# Altium project pollution_analyser.PrjPCB
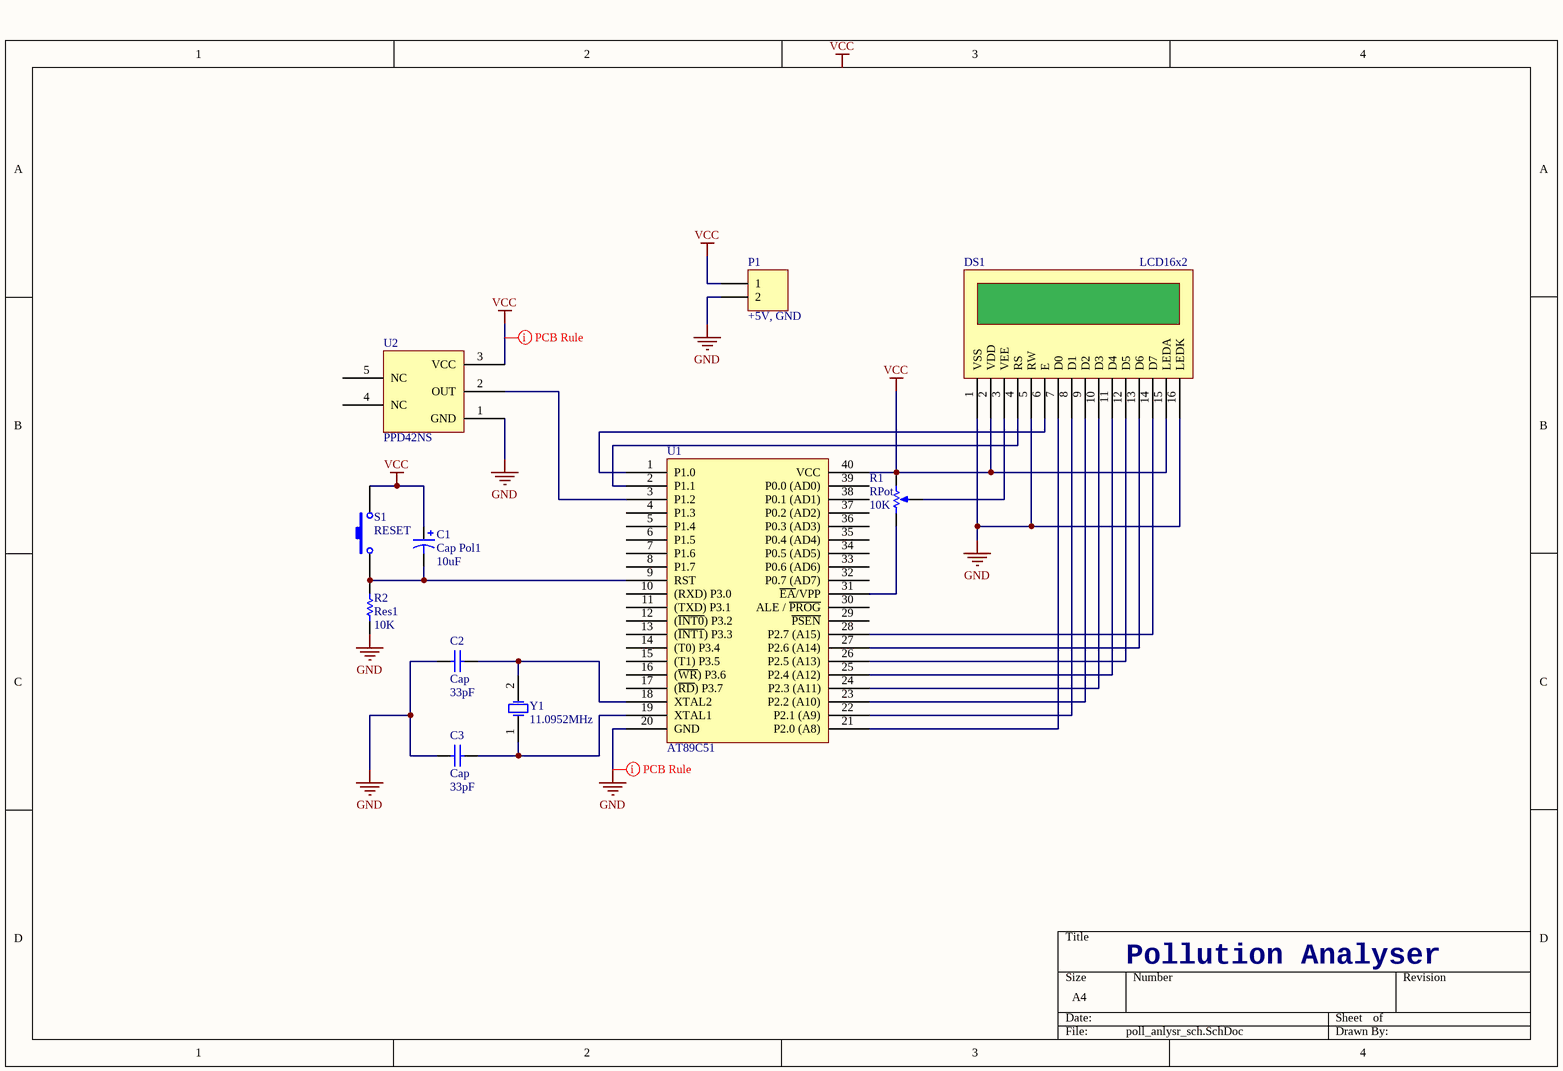
[diagram p0: poll_anlysr_sch.SchDoc]
1 sheet, 11 parts. Net scope: global (net labels, ports and power ports of the same name join across sheets).
Board file: poll_anlysr_pcb.PcbDoc

## Sheet poll_anlysr_sch.SchDoc
size A4

### Parts
C1  Cap Pol1  value 10uF  [CAPR5-4X5]
C2  Cap  value 33pF  [CAPR5-4X5]
C3  Cap  value 33pF  [CAPR5-4X5]
DS1  LCD16x2  [LCD_16x2]
P1  +5V, GND  [HDR1X2]
R1  RPot  value 10K  [Rpot]
R2  Res1  value 10K  [AXIAL-0.3]
S1  RESET  [SWpush]
U1  AT89C51  [AT89C51]
U2  PPD42NS  [PPD42NS]
Y1  11.0952MHz  [HC-49U]

### Nets
GND: C2.1 C3.1 DS1.1(VSS) DS1.5(RW) DS1.16(LEDK) P1.2 R2.2 U1.20(GND) U2.1(GND)
VCC: C1.1 DS1.2(VDD) DS1.15(LEDA) P1.1 R1.2(BOT) S1.2 U1.40(VCC) U2.3(VCC)
NetC1_2: C1.2 R2.1 S1.1 U1.9(RST)
NetC2_2: C2.2 U1.18(XTAL2) Y1.2(OSC2)
NetC3_2: C3.2 U1.19(XTAL1) Y1.1(OSC1)
NetDS1_3: DS1.3(VEE) R1.3(TAP)
NetDS1_4: DS1.4(RS) U1.2(P1.1)
NetDS1_6: DS1.6(E) U1.1(P1.0)
NetDS1_7: DS1.7(D0) U1.21(P2.0_(A8))
NetDS1_8: DS1.8(D1) U1.22(P2.1_(A9))
NetDS1_9: DS1.9(D2) U1.23(P2.2_(A10))
NetDS1_10: DS1.10(D3) U1.24(P2.3_(A11))
NetDS1_11: DS1.11(D4) U1.25(P2.4_(A12))
NetDS1_12: DS1.12(D5) U1.26(P2.5_(A13))
NetDS1_13: DS1.13(D6) U1.27(P2.6_(A14))
NetDS1_14: DS1.14(D7) U1.28(P2.7_(A15))
NetR1_1: R1.1(TOP) U1.31(~{EA}/VPP)
NetU1_3: U1.3(P1.2) U2.2(OUT)

Not connected (* = marked no-connect by the designer): U1 4(P1.3) 5(P1.4) 6(P1.5) 7(P1.6) 8(P1.7) 10((RXD)_P3.0) 11((TXD)_P3.1) 12((~{INT0})_P3.2) 13((~{INT1})_P3.3) 14((T0)_P3.4) 15((T1)_P3.5) 16((~{WR})_P3.6) 17((~{RD})_P3.7) 29(~{PSEN}) 30(ALE_/_~{PROG}) 32(P0.7_(AD7)) 33(P0.6_(AD6)) 34(P0.5_(AD5)) 35(P0.4_(AD4)) 36(P0.3_(AD3)) 37(P0.2_(AD2)) 38(P0.1_(AD1)) 39(P0.0_(AD0)); U2 4(NC) 5(NC)

### Layout directives
rule Width Constraint [Pref Width = 1.5mm    Min Width = 1.5mm    Max Width = 1.5mm]: GND
rule Width Constraint [Pref Width = 59.055mil    Min Width = 59.055mil    Max Width = 59.055mil]: VCC

### Notes on the sheet
- Pollution Analyser
- Labels drawn without touching a wire or pin: VCC

### Library data of the parts
C1 = Cap Pol1: Polarized Capacitor; Published: 8-Jun-2000; LatestRevisionDate: 17-Jul-2002; LatestRevisionNote: Re-released for DXP Platform.; PackageReference: RB7.6-15; Publisher: Altium Limited; PackageDescription: Polarized Capacitor (Radial); 2 Leads
C2 C3 = Cap: Capacitor; Published: 8-Jun-2000; LatestRevisionDate: 17-Jul-2002; LatestRevisionNote: Re-released for DXP Platform.; PackageReference: RAD-0.3; Publisher: Altium Limited; PackageDescription: Radial Cap, Thru-Hole; 2 Leads; 0.3 in Pin Spacing
DS1 = LCD16x2: Dsiplay
P1 = Header 2: 2-Pin Header; LatestRevisionDate: 17-Jul-2002; LatestRevisionNote: Re-released for DXP Platform.; Publisher: Altium Limited
R1 = RPot: Potentiometer; Sim Note: Enter the Resistance value and the set point into parameter fields.; Set Position: 0.5; Published: 8-Jun-2000; LatestRevisionDate: 17-Jul-2002; LatestRevisionNote: Re-released for DXP Platform.; PackageReference: VR5; Publisher: Altium Limited; PackageDescription: Variable Resistor, Thru-Hole; 3 Leads
R2 = Res1: Resistor; Published: 8-Jun-2000; LatestRevisionDate: 17-Jul-2002; LatestRevisionNote: Re-released for DXP Platform.; PackageReference: AXIAL-0.3; Publisher: Altium Limited; PackageDescription: Axial Device, Thru-Hole; 2 Leads; 0.3 in Pin Spacing
S1 = SW-PB: Switch; pin to pad: 2>4; Published: 24-Mar-1999; LatestRevisionDate: 17-Jul-2002; LatestRevisionNote: Re-released for DXP Platform.; PackageReference: SPST-2; Publisher: Altium Limited; PackageDescription: Switch; 2 Leads
U1 = AT89C51: 8-bit uC
U2 = PPD42NS: Dust Sensor
Y1 = XTAL: Crystal Oscillator; Published: 8-Jun-2000; LatestRevisionDate: 17-Jul-2002; LatestRevisionNote: Re-released for DXP Platform.; PackageReference: R38; Publisher: Altium Limited; PackageDescription: Crystal, Thru-Hole; 2 Leads; Body 3.1 x 8.2 mm (Dia.xH)